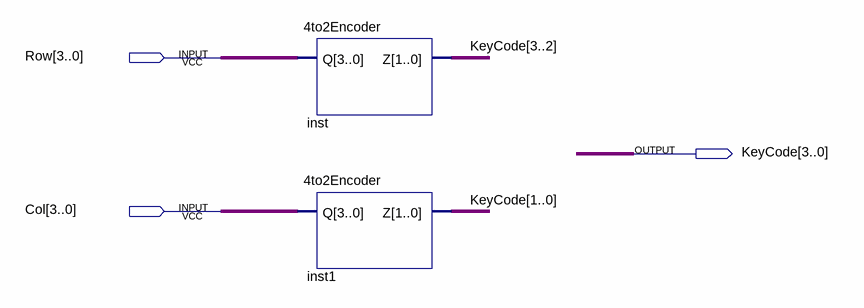
[diagram p0: schematic sheet]
// Quartus schematic Encoder.bdf as structural Verilog: 2 symbols, 3 pins
module Encoder (
  input  [3:0] Row,
  input  [3:0] Col,
  output [3:0] KeyCode
);

  \4to2Encoder  inst (.Q(Row), .Z(KeyCode[3:2]));
  \4to2Encoder  inst1 (.Q(Col), .Z(KeyCode[1:0]));
endmodule
